# EAGLE design Constant_Register (EAGLE 9.6.2)
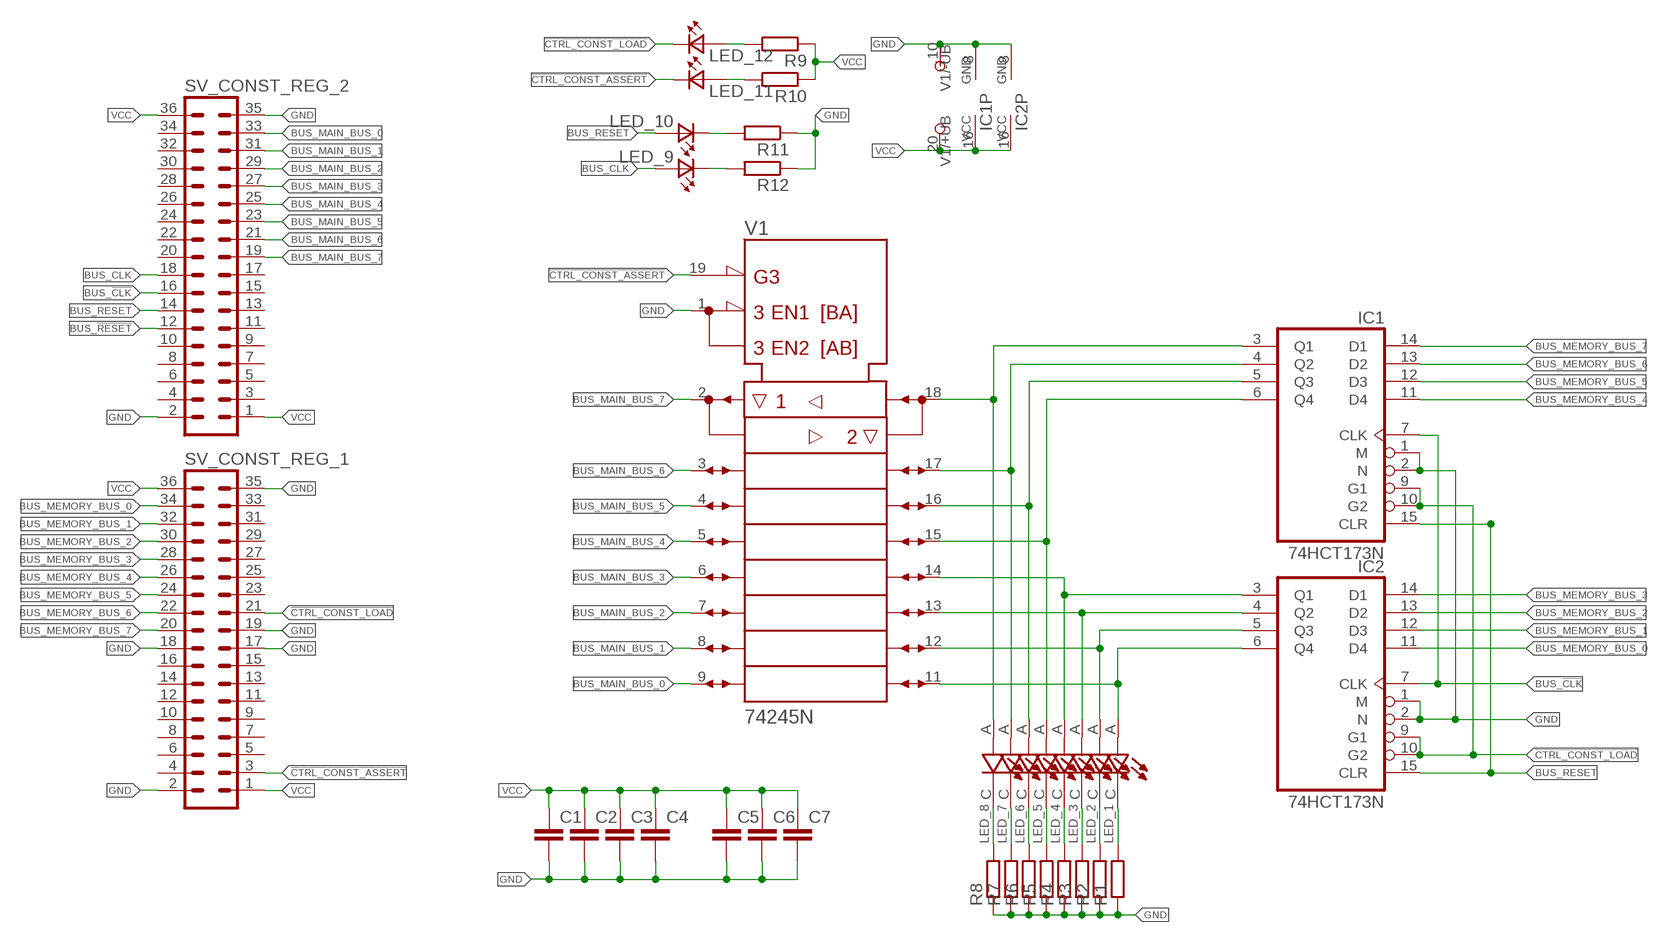
[diagram p0: schematic, sheet 1]

## Parts
C1  C-EUC0805  [C0805]
C2  C-EUC0805  [C0805]
C3  C-EUC0805  [C0805]
C4  C-EUC0805  [C0805]
C5  C-EUC0805  [C0805]
C6  C-EUC0805  [C0805]
C7  C-EUC0805  [C0805]
IC1  74HCT173N  [DIL16]
IC2  74HCT173N  [DIL16]
LED_1  LTST-C193KRKT-5A  [LEDC1608X45N]
LED_2  LTST-C193KRKT-5A  [LEDC1608X45N]
LED_3  LTST-C193KRKT-5A  [LEDC1608X45N]
LED_4  LTST-C193KRKT-5A  [LEDC1608X45N]
LED_5  LTST-C193KRKT-5A  [LEDC1608X45N]
LED_6  LTST-C193KRKT-5A  [LEDC1608X45N]
LED_7  LTST-C193KRKT-5A  [LEDC1608X45N]
LED_8  LTST-C193KRKT-5A  [LEDC1608X45N]
LED_9  LTST-C193TBKT-5A  [0603]
LED_10  LTST-C193TBKT-5A  [0603]
LED_11  LTST-C193TBKT-5A  [0603]
LED_12  LTST-C193TBKT-5A  [0603]
R1  R-EU_R0805  [R0805]
R2  R-EU_R0805  [R0805]
R3  R-EU_R0805  [R0805]
R4  R-EU_R0805  [R0805]
R5  R-EU_R0805  [R0805]
R6  R-EU_R0805  [R0805]
R7  R-EU_R0805  [R0805]
R8  R-EU_R0805  [R0805]
R9  R-EU_R0805  [R0805]
R10  R-EU_R0805  [R0805]
R11  R-EU_R0805  [R0805]
R12  R-EU_R0805  [R0805]
SV_CONST_REG_1  MA18-2  [MA18-2]
SV_CONST_REG_2  MA18-2  [MA18-2]
V1  74245N  [DIL20]

## Nets
!CTRL_CONST_ASSERT: LED_11.1(K2) SV_CONST_REG_1.3 V1.19(!G)
!CTRL_CONST_LOAD: IC1.9(G1) IC1.10(G2) IC2.9(G1) IC2.10(G2) LED_12.1(K2) SV_CONST_REG_1.21
BUS_!CLK: IC1.7(CLK) IC2.7(CLK) SV_CONST_REG_2.16
BUS_!RESET: SV_CONST_REG_2.12
BUS_CLK: LED_9.2(A2) SV_CONST_REG_2.18
BUS_MAIN_BUS_0: SV_CONST_REG_2.33 V1.9(A8)
BUS_MAIN_BUS_1: SV_CONST_REG_2.31 V1.8(A7)
BUS_MAIN_BUS_2: SV_CONST_REG_2.29 V1.7(A6)
BUS_MAIN_BUS_3: SV_CONST_REG_2.27 V1.6(A5)
BUS_MAIN_BUS_4: SV_CONST_REG_2.25 V1.5(A4)
BUS_MAIN_BUS_5: SV_CONST_REG_2.23 V1.4(A3)
BUS_MAIN_BUS_6: SV_CONST_REG_2.21 V1.3(A2)
BUS_MAIN_BUS_7: SV_CONST_REG_2.19 V1.2(A1)
BUS_MEMORY_BUS_0: IC2.11(D4) SV_CONST_REG_1.34
BUS_MEMORY_BUS_1: IC2.12(D3) SV_CONST_REG_1.32
BUS_MEMORY_BUS_2: IC2.13(D2) SV_CONST_REG_1.30
BUS_MEMORY_BUS_3: IC2.14(D1) SV_CONST_REG_1.28
BUS_MEMORY_BUS_4: IC1.11(D4) SV_CONST_REG_1.26
BUS_MEMORY_BUS_5: IC1.12(D3) SV_CONST_REG_1.24
BUS_MEMORY_BUS_6: IC1.13(D2) SV_CONST_REG_1.22
BUS_MEMORY_BUS_7: IC1.14(D1) SV_CONST_REG_1.20
BUS_RESET: IC1.15(CLR) IC2.15(CLR) LED_10.2(A2) SV_CONST_REG_2.14
GND: C1.2 C2.2 C3.2 C4.2 C5.2 C6.2 C7.2 IC1.1(M) IC1.2(N) IC1.8(GND) IC2.1(M) IC2.2(N) IC2.8(GND) R1.1 R2.1 R3.1 R4.1 R5.1 R6.1 R7.1 R8.1 R11.1 R12.1 SV_CONST_REG_1.2 SV_CONST_REG_1.17 SV_CONST_REG_1.18 SV_CONST_REG_1.19 SV_CONST_REG_1.35 SV_CONST_REG_2.2 SV_CONST_REG_2.35 V1.1(DIR) V1.10(-UB)
N$1: LED_8.C R8.2
N$2: LED_7.C R7.2
N$3: LED_6.C R6.2
N$4: LED_5.C R5.2
N$5: LED_4.C R4.2
N$6: LED_3.C R3.2
N$7: LED_2.C R2.2
N$8: LED_1.C R1.2
N$9: IC2.3(Q1) LED_4.A V1.14(B5)
N$10: IC1.4(Q2) LED_7.A V1.17(B2)
N$11: IC2.6(Q4) LED_1.A V1.11(B8)
N$12: IC2.5(Q3) LED_2.A V1.12(B7)
N$13: IC2.4(Q2) LED_3.A V1.13(B6)
N$14: IC1.6(Q4) LED_5.A V1.15(B4)
N$15: IC1.5(Q3) LED_6.A V1.16(B3)
N$16: IC1.3(Q1) LED_8.A V1.18(B1)
N$17: LED_11.2(A2) R10.2
N$18: LED_12.2(A2) R9.2
N$19: LED_9.1(K2) R12.2
N$20: LED_10.1(K2) R11.2
VCC: C1.1 C2.1 C3.1 C4.1 C5.1 C6.1 C7.1 IC1.16(VCC) IC2.16(VCC) R9.1 R10.1 SV_CONST_REG_1.1 SV_CONST_REG_1.36 SV_CONST_REG_2.1 SV_CONST_REG_2.36 V1.20(+UB)
Unconnected: SV_CONST_REG_1.4 SV_CONST_REG_1.5 SV_CONST_REG_1.6 SV_CONST_REG_1.7 SV_CONST_REG_1.8 SV_CONST_REG_1.9 SV_CONST_REG_1.10 SV_CONST_REG_1.11 SV_CONST_REG_1.12 SV_CONST_REG_1.13 SV_CONST_REG_1.14 SV_CONST_REG_1.15 SV_CONST_REG_1.16 SV_CONST_REG_1.23 SV_CONST_REG_1.25 SV_CONST_REG_1.27 SV_CONST_REG_1.29 SV_CONST_REG_1.31 SV_CONST_REG_1.33 SV_CONST_REG_2.3 SV_CONST_REG_2.4 SV_CONST_REG_2.5 SV_CONST_REG_2.6 SV_CONST_REG_2.7 SV_CONST_REG_2.8 SV_CONST_REG_2.9 SV_CONST_REG_2.10 SV_CONST_REG_2.11 SV_CONST_REG_2.13 SV_CONST_REG_2.15 SV_CONST_REG_2.17 SV_CONST_REG_2.20 SV_CONST_REG_2.22 SV_CONST_REG_2.24 SV_CONST_REG_2.26 SV_CONST_REG_2.28 SV_CONST_REG_2.30 SV_CONST_REG_2.32 SV_CONST_REG_2.34

## Library data of the parts
C1-C7 = rcl:C-EU: CAPACITOR, European symbol; SPICEPREFIX: C
IC1 IC2 = 74xx-eu:74*173: 4-bit D type REGISTER, 3-state
LED_1-LED_8 = Dargon's_lib:LTST-C193KRKT-5A: Red 631nm LED Indication - Discrete 2V 0603 (1608 Metric); MANUFACTURER: Lite-On; MAXIMUM_PACKAGE_HEIGHT: 0.45 mm; PARTREV: C; STANDARD: IPC 7351B
LED_9-LED_12 = Dargon's_lib:LTST-C193TBKT-5A: http://octopart.com/ltst-c190tbkt-lite-on-550003
R1-R12 = rcl:R-EU_: RESISTOR, European symbol; SPICEPREFIX: R
SV_CONST_REG_1 SV_CONST_REG_2 = con-lstb:MA18-2: PIN HEADER; OC_FARNELL: unknown; OC_NEWARK: unknown
V1 = 74ttl-din:74*245: Octal BUS TRANSCEIVER, 3-state

## Board
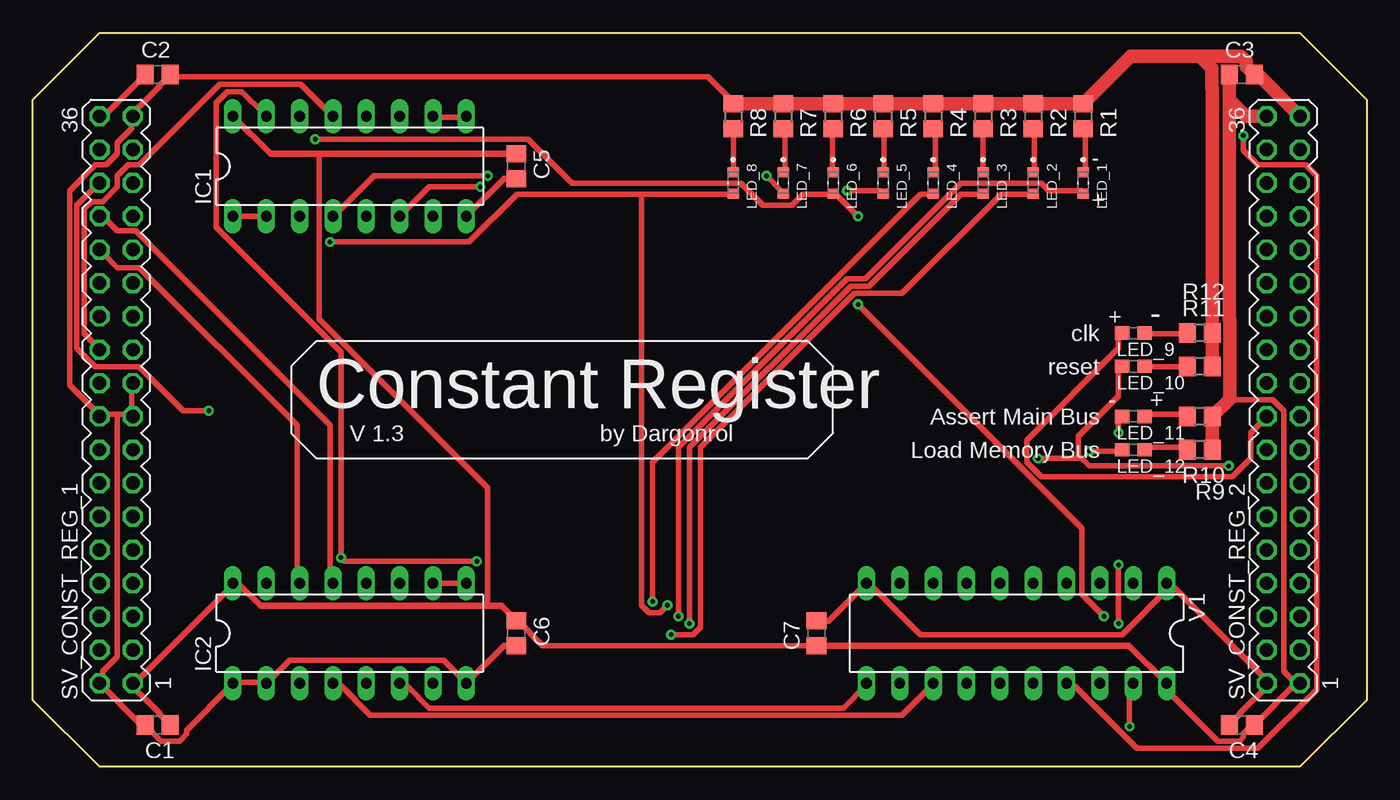
[diagram p1: board, top side]
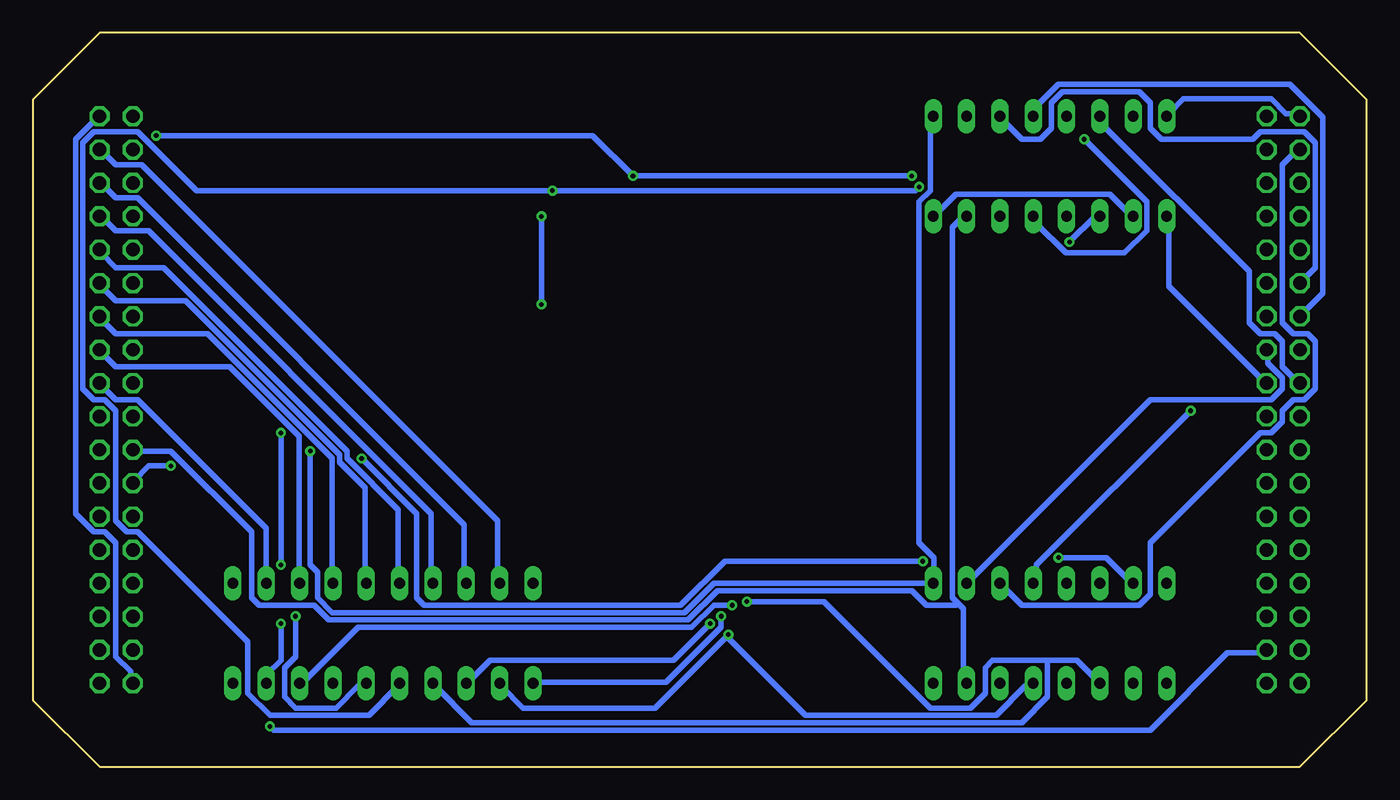
[diagram p2: board, bottom side, seen from below]

Size 101.6 x 55.88 mm. Coordinates in mm from the lower left corner, seen from the top.
Outline: 5.08,0 0,5.08 0,50.8 5.08,55.88 96.52,55.88 101.6,50.8 101.6,5.08 96.52,0 5.08,0
Copper layers (1*16): Top 0.035mm / dielectric 1.5mm / Bottom 0.035mm
Design rules "default *": minimum track width 16mil, minimum drill 0.35mm, track to track 6mil, track to pad 6mil, pad to pad 6mil, via to via 6mil, smd to smd 6mil, copper to edge 40mil, drill to drill 6mil, minimum pad ring 10mil, minimum via ring 8mil, stop-mask expansion 4mil, vias tented up to drill 0mil, thermal gap 10mil

### Footprints (pad centres in the part's own frame; a part is rotated, then mirrored left to right if it is on the bottom)
C0805 = smd 1.3 x 1.5: 1 -0.95,0; 2 0.95,0
DIL16 = drill 0.813 long: 1 -8.89,-3.81; 2 -6.35,-3.81; 3 -3.81,-3.81; 4 -1.27,-3.81; 5 1.27,-3.81; 6 3.81,-3.81; 7 6.35,-3.81; 8 8.89,-3.81; 9 8.89,3.81; 10 6.35,3.81; 11 3.81,3.81; 12 1.27,3.81; 13 -1.27,3.81; 14 -3.81,3.81; 15 -6.35,3.81; 16 -8.89,3.81
LEDC1608X45N = smd 0.81 x 0.93: A 0.81,0; C -0.81,0
0603 = smd 1.1 x 1: 1 -0.85,0; 2 0.85,0
R0805 = smd 1.3 x 1.5: 1 -0.95,0; 2 0.95,0
MA18-2 = drill 1.016 octagon: 1 -21.59,-1.27; 2 -21.59,1.27; 3 -19.05,-1.27; 4 -19.05,1.27; 5 -16.51,-1.27; 6 -16.51,1.27; 7 -13.97,-1.27; 8 -13.97,1.27; 9 -11.43,-1.27; 10 -11.43,1.27; 11 -8.89,-1.27; 12 -8.89,1.27; 13 -6.35,-1.27; 14 -6.35,1.27; 15 -3.81,-1.27; 16 -3.81,1.27; 17 -1.27,-1.27; 18 -1.27,1.27; 19 1.27,-1.27; 20 1.27,1.27; 21 3.81,-1.27; 22 3.81,1.27; 23 6.35,-1.27; 24 6.35,1.27; 25 8.89,-1.27; 26 8.89,1.27; 27 11.43,-1.27; 28 11.43,1.27; 29 13.97,-1.27; 30 13.97,1.27; 31 16.51,-1.27; 32 16.51,1.27; 33 19.05,-1.27; 34 19.05,1.27; 35 21.59,-1.27; 36 21.59,1.27
DIL20 = drill 0.813 long: 1 -11.43,-3.81; 2 -8.89,-3.81; 3 -6.35,-3.81; 4 -3.81,-3.81; 5 -1.27,-3.81; 6 1.27,-3.81; 7 3.81,-3.81; 8 6.35,-3.81; 9 8.89,-3.81; 10 11.43,-3.81; 11 11.43,3.81; 12 8.89,3.81; 13 6.35,3.81; 14 3.81,3.81; 15 1.27,3.81; 16 -1.27,3.81; 17 -3.81,3.81; 18 -6.35,3.81; 19 -8.89,3.81; 20 -11.43,3.81

### Placement (x,y rotation side)
C1  9.53,3.17 180 top
C2  9.53,52.7 0 top
C3  92.08,52.7 0 top
C4  92.08,3.17 180 top
C5  36.83,45.72 270 top
C6  36.83,10.16 270 top
C7  59.69,10.16 90 top
IC1  24.13,45.72 0 top
IC2  24.13,10.16 0 top
LED_1  80.01,44.45 270 top
LED_2  76.2,44.45 270 top
LED_3  72.39,44.45 270 top
LED_4  68.58,44.45 270 top
LED_5  64.77,44.45 270 top
LED_6  60.96,44.45 270 top
LED_7  57.15,44.45 270 top
LED_8  53.34,44.45 270 top
LED_9  83.82,33.02 180 top
LED_10  83.82,30.48 180 top
LED_11  83.82,26.67 0 top
LED_12  83.82,24.13 0 top
R1  80.01,49.53 270 top
R2  76.2,49.53 270 top
R3  72.39,49.53 270 top
R4  68.58,49.53 270 top
R5  64.77,49.53 270 top
R6  60.96,49.53 270 top
R7  57.15,49.53 270 top
R8  53.34,49.53 270 top
R9  88.9,24.13 180 top
R10  88.9,26.67 180 top
R11  88.9,30.48 180 top
R12  88.9,33.02 180 top
SV_CONST_REG_1  6.35,27.94 90 top
SV_CONST_REG_2  95.25,27.94 90 top
V1  74.93,10.16 180 top

### Tracks (layer width: path | path; a pad name or v marks a point on that pad's centre or on a via)
!CTRL_CONST_ASSERT  (via drill 0.35)
  Top 0.406: v82.7,25.43 82.7,26.54 LED_11.1 | v82.7,10.9 v82.7,15.37 | v83.54,3.07 83.54,5.87 83.82,6.15 V1.19
  Bottom 0.406: v82.7,15.37 v82.7,25.43 | v82.7,10.9 82.7,8.1 83.82,6.99 V1.19 | v83.54,3.07 83.26,2.79 16.48,2.79 10.62,8.66 7.82,8.66 SV_CONST_REG_1.3
!CTRL_CONST_LOAD  (via drill 0.35)
  Top 0.406: IC1.10 30.73,49.45 32.97,49.45 IC1.9 | v80.47,24.03 82.7,24.03 LED_12.1 | IC2.9 IC2.10
  Bottom 0.406: v80.47,24.03 80.47,15.37 79.91,14.81 79.91,12.85 78.79,11.73 51.97,11.73 49.73,13.97 IC2.9 32.97,13.97 32.97,15.93 34.09,17.04 34.09,43.03 33.25,43.87 33.25,49.45 IC1.9 | SV_CONST_REG_1.21 7.54,31.57 7.54,30.73 6.43,29.62 6.43,28.78 7.26,27.94 16.48,27.94 30.45,13.97 IC2.10
BUS_!CLK
  Bottom 0.406: 31.15,12.43 31.57,12.85 31.57,41.07 30.73,41.91 IC1.7 | 31.15,12.43 30.73,12.01 30.73,6.43 IC2.7 | SV_CONST_REG_2.16 93.88,24.03 91.08,24.03 84.94,17.88 84.94,12.85 84.38,12.29 80.19,12.29 79.07,11.18 51.69,11.18 49.45,13.41 34.65,13.41 33.53,12.29 31.29,12.29 31.15,12.43
BUS_CLK
  Top 0.406: LED_9.2 82.7,32.97 82.7,31.85 75.72,24.87 75.72,23.19 76.83,22.07 91.36,22.07 92.76,23.47 92.76,25.43 93.88,26.54 SV_CONST_REG_2.18
BUS_MAIN_BUS_0
  Bottom 0.406: V1.9 66.22,13.97 66.22,18.72 93.32,45.82 95.28,45.82 96.39,46.94 SV_CONST_REG_2.33
BUS_MAIN_BUS_1
  Bottom 0.406: V1.8 68.73,13.97 68.73,18.44 93.6,43.31 95.28,43.31 96.39,44.42 SV_CONST_REG_2.31
BUS_MAIN_BUS_2
  Bottom 0.406: V1.7 71.25,13.97 71.25,19.28 92.76,40.79 95.28,40.79 96.39,41.91 SV_CONST_REG_2.29
BUS_MAIN_BUS_3
  Bottom 0.406: V1.6 73.76,13.97 73.76,19.56 77.67,23.47 77.67,24.03 91.64,38 95.28,38 96.39,39.12 SV_CONST_REG_2.27
BUS_MAIN_BUS_4
  Bottom 0.406: V1.5 76.28,13.97 76.28,21.23 78.23,23.19 78.23,23.75 89.97,35.48 95.28,35.48 96.39,36.6 SV_CONST_REG_2.25
BUS_MAIN_BUS_5
  Bottom 0.406: V1.4 78.79,13.97 78.79,23.47 88.29,32.97 95.28,32.97 96.39,34.09 SV_CONST_REG_2.23
BUS_MAIN_BUS_6
  Bottom 0.406: V1.3 81.31,13.97 81.31,25.15 86.61,30.45 95.28,30.45 96.39,31.57 SV_CONST_REG_2.21
BUS_MAIN_BUS_7
  Bottom 0.406: V1.2 83.82,18.16 93.6,27.94 95.28,27.94 96.39,29.06 SV_CONST_REG_2.19
BUS_MEMORY_BUS_0
  Bottom 0.406: IC2.11 26.26,12.29 17.32,12.29 16.48,13.13 16.48,17.04 8.1,25.43 7.26,25.43 6.43,26.26 6.43,27.1 5.59,27.94 4.75,27.94 3.91,28.78 3.91,32.41 4.47,32.97 5.59,32.97 6.43,33.81 6.43,45.82 5.31,46.94 SV_CONST_REG_1.34
BUS_MEMORY_BUS_1  (via drill 0.35)
  Top 0.406: v13.41,27.1 11.46,27.1 8.1,30.45 4.75,30.45 3.35,31.85 3.35,42.75 5.03,44.42 SV_CONST_REG_1.32
  Bottom 0.406: v13.41,27.1 25.15,15.37 25.15,13.97 IC2.12
BUS_MEMORY_BUS_2
  Top 0.406: IC2.13 22.63,13.97 22.63,25.98 7.82,40.79 6.43,40.79 5.31,41.91 SV_CONST_REG_1.30
BUS_MEMORY_BUS_3
  Top 0.406: IC2.14 20.12,13.97 20.12,25.98 8.1,38 6.43,38 5.31,39.12 SV_CONST_REG_1.28
BUS_MEMORY_BUS_4
  Bottom 0.406: SV_CONST_REG_1.26 3.91,38 3.91,47.5 4.75,48.34 8.1,48.34 8.66,47.78 15.65,47.78 16.48,48.62 16.48,50.57 17.32,51.41 23.19,51.41 24.03,50.57 24.03,48.62 24.87,47.78 26.26,47.78 27.94,49.45 IC1.11
BUS_MEMORY_BUS_5
  Bottom 0.406: IC1.12 25.15,49.73 25.15,50.29 23.47,51.97 5.87,51.97 3.35,49.45 3.35,36.04 5.03,34.37 SV_CONST_REG_1.24
BUS_MEMORY_BUS_6
  Top 0.406: IC1.13 22.63,49.73 20.4,51.97 14.25,51.97 8.1,45.82 7.26,45.82 6.43,44.98 6.43,44.15 5.31,43.03 4.47,43.03 3.91,42.47 3.91,32.97 5.03,31.85 SV_CONST_REG_1.22
BUS_MEMORY_BUS_7
  Bottom 0.406: IC1.14 20.12,49.45 20.12,48.9 8.94,37.72 8.94,33.81 8.1,32.97 6.99,32.97 6.43,32.41 6.43,30.45 5.31,29.34 SV_CONST_REG_1.20
BUS_RESET  (via drill 0.35)
  Top 0.406: 79.77,23.61 80.47,22.91 v91.08,22.91 | 79.77,23.61 79.63,23.75 79.63,25.15 82.7,28.22 82.7,30.45 LED_10.2 | IC1.15 17.6,49.73 15.93,51.41 14.81,51.41 13.97,50.57 13.97,41.07 23.47,31.57 v23.47,15.93 23.75,15.65 v33.81,15.65 | v76.56,23.47 79.63,23.47 79.77,23.61
  Bottom 0.406: v91.08,22.91 92.76,22.91 93.88,21.79 SV_CONST_REG_2.14 | v23.47,15.93 19.84,15.93 17.88,13.97 IC2.15 | v76.56,23.47 72.36,19.28 72.36,12.85 71.81,12.29 52.25,12.29 48.9,15.65 v33.81,15.65
GND
  Top 0.406: C1.2 8.66,3.07 9.78,1.96 11.18,1.96 11.73,2.52 11.73,2.79 15.09,6.15 IC2.1 15.37,6.43 17.6,6.43 IC2.2 17.88,6.43 19.56,8.1 31.29,8.1 32.97,6.43 IC2.8 | IC1.2 IC1.1 | 7.54,26.82 6.43,26.82 | 6.43,26.82 5.31,26.82 SV_CONST_REG_1.18 5.03,26.82 2.79,29.06 2.79,43.87 4.75,45.82 5.59,45.82 6.43,46.66 6.43,47.5 7.54,48.62 7.54,49.45 SV_CONST_REG_1.35 | 7.54,26.82 7.54,29.06 SV_CONST_REG_1.19 | 7.54,26.82 SV_CONST_REG_1.17 | 6.43,26.82 6.43,8.38 5.31,7.26 5.31,6.43 SV_CONST_REG_1.2 | SV_CONST_REG_2.2 94.16,6.43 86.61,13.97 V1.1 86.61,13.69 82.98,10.06 67.61,10.06 63.7,13.97 V1.10 | C2.2 10.62,52.53 51.41,52.53 53.09,50.85 R8.1
  Top 0.508: C2.2 9.63,51.86 9.63,51.79 7.62,49.77 SV_CONST_REG_1.35 | C5.2 35.88,44.77 IC1.8 | C6.2 35.88,9.21 IC2.8 | C1.2 8.26,3.17 SV_CONST_REG_1.2 | C7.2 60.64,11.11 V1.10 | C4.2 91.97,4.02 91.97,4.09 93.98,6.11 SV_CONST_REG_2.2 | C3.2 93.34,52.7
  Top 1.016: 93.34,52.7 SV_CONST_REG_2.35 | R8.1 R7.1 R6.1 R5.1 R4.1 R3.1 R2.1 R1.1 83.64,54.12 88.9,54.12 | C3.2 92.44,53.3 92.44,53.73 92.05,54.12 88.9,54.12 | R11.1 R12.1 89.85,51.65 89.81,51.68 89.81,53.2 88.9,54.12
  Bottom 0.406: IC1.1 15.09,41.91 15.09,36.6 7.82,29.34 SV_CONST_REG_1.19 | IC1.8 32.97,41.91 31.29,43.59 19.56,43.59 17.88,41.91 IC1.2 | SV_CONST_REG_2.2 94.16,6.43 94.16,7.26 95.28,8.38 95.28,17.04 96.11,17.88 96.95,17.88 98.35,19.28 98.35,47.78 96.67,49.45 SV_CONST_REG_2.35
N$1
  Top 0.406: LED_8.C 53.37,45.26 53.37,48.34 R8.2
N$2
  Top 0.406: LED_7.C 57.28,45.26 57.28,48.34 R7.2
N$3
  Top 0.406: LED_6.C 60.91,45.26 60.91,48.34 R6.2
N$4
  Top 0.406: LED_5.C 64.82,45.26 64.82,48.34 R5.2
N$5
  Top 0.406: LED_4.C 68.73,45.26 68.73,48.34 R4.2
N$6
  Top 0.406: LED_3.C 72.36,45.26 72.36,48.34 R3.2
N$7
  Top 0.406: LED_2.C 76.28,45.26 76.28,48.34 R2.2
N$8
  Top 0.406: LED_1.C 80.19,45.26 80.19,48.34 R1.2
N$9  (via drill 0.35)
  Top 0.406: v47.22,12.57 47.22,23.19 67.61,43.59 68.45,43.59 LED_4.A
  Bottom 0.406: v47.22,12.57 41.35,12.57 33.25,4.47 30.18,4.47 29.06,5.59 29.06,7.54 28.5,8.1 24.31,8.1 | 24.31,8.1 22.07,8.1 IC2.3 | 24.31,8.1 24.31,5.31 26.26,3.35 68.17,3.35 70.97,6.15 V1.14
N$10  (via drill 0.35)
  Top 0.406: v55.88,44.98 57,43.87 LED_7.A | v34.65,44.98 25.98,44.98 22.91,41.91 IC1.4 | v92.2,48.06 92.2,46.94 93.32,45.82 96.95,45.82 97.79,44.98 97.79,5.87 93.32,1.4 84.1,1.4 79.35,6.15 78.79,6.15 V1.17
  Bottom 0.406: v34.65,44.98 v55.88,44.98 58.95,48.06 v92.2,48.06
N$11  (via drill 0.35)
  Top 0.406: v49.17,11.46 49.17,24.31 62.03,37.16 63.42,37.16 70.69,44.42 76.83,44.42 77.39,43.87 79.91,43.87 LED_1.A | IC2.6 27.94,6.15 28.5,6.15 30.18,4.47 61.75,4.47 63.42,6.15 V1.11
  Bottom 0.406: v49.17,11.46 49.17,10.62 53.37,6.43 63.42,6.43 V1.11
N$12  (via drill 0.35)
  Top 0.406: v48.62,10.06 50.29,10.06 50.85,10.62 50.85,24.31 62.59,36.04 66.22,36.04 73.76,43.59 76,43.59 LED_2.A
  Bottom 0.406: V1.12 65.94,6.15 64.26,4.47 54.2,4.47 v48.62,10.06 48.62,9.78 42.75,3.91 28.22,3.91 25.98,6.15 25.43,6.15 IC2.5
N$13  (via drill 0.35)
  Top 0.406: v50.01,10.9 50.01,24.31 62.31,36.6 63.7,36.6 70.69,43.59 72.36,43.59 LED_3.A | IC2.4 22.91,6.15 23.47,6.15 25.7,3.91 66.22,3.91 68.45,6.15 V1.13
  Bottom 0.406: v50.01,10.9 52.81,8.1 66.78,8.1 68.45,6.43 V1.13
N$14  (via drill 0.35)
  Top 0.406: v62.03,43.87 64.54,43.87 LED_5.A | v34.09,44.15 30.18,44.15 IC1.6
  Bottom 0.406: v34.09,44.15 34.37,43.87 v62.03,43.87 89.13,43.87 93.6,48.34 96.95,48.34 97.79,47.5 97.79,28.78 96.95,27.94 96.11,27.94 95.28,27.1 95.28,18.72 94.44,17.88 93.6,17.88 85.22,9.5 85.22,5.59 83.54,3.91 76,3.91 73.76,6.15 V1.15
N$15  (via drill 0.35)
  Top 0.406: v21.51,47.78 37.72,47.78 41.07,44.42 53.92,44.42 55.6,42.75 57.84,42.75 58.67,43.59 60.91,43.59 LED_6.A 61.19,43.59 v62.87,41.91 | v81.58,11.46 79.91,13.13 79.91,18.16 v62.87,35.2
  Bottom 0.406: v21.51,47.78 16.76,43.03 16.76,40.79 18.44,39.12 22.91,39.12 25.15,41.35 25.15,41.91 IC1.5 | v81.58,11.46 81.58,8.38 82.42,7.54 82.42,5.31 81.58,4.47 78.51,4.47 76.83,6.15 76.28,6.15 V1.16 | v62.87,41.91 v62.87,35.2
N$16  (via drill 0.35)
  Top 0.406: 46.38,43.59 36.88,43.59 33.25,39.95 v22.63,39.95 | 46.38,43.59 53.09,43.59 LED_8.A | v48.34,12.29 47.78,11.73 46.94,11.73 46.38,12.29 46.38,43.59
  Bottom 0.406: v22.63,39.95 20.68,41.91 IC1.3 | v48.34,12.29 49.73,12.29 51.41,10.62 76.83,10.62 81.03,6.43 V1.18
N$17
  Top 0.406: LED_11.2 84.94,26.82 87.73,26.82 R10.2
N$18
  Top 0.406: LED_12.2 84.94,24.31 87.73,24.31 R9.2
N$19
  Top 0.406: LED_9.1 84.94,32.97 87.73,32.97 R12.2
N$20
  Top 0.406: LED_10.1 84.94,30.45 87.73,30.45 R11.2
VCC
  Top 0.406: C4.1 92.76,3.07 92.2,2.52 92.2,2.23 91.92,1.96 90.25,1.96 86.61,5.59 86.61,6.15 V1.20 | 15.37,13.97 7.82,6.43 SV_CONST_REG_1.1 | C7.1 59.51,9.22 38.84,9.22 36.88,11.18 C6.1 | 21.79,46.67 21.79,34.09 34.65,21.23 34.65,12.24 | 91.16,27.98 91.64,27.94 94.44,27.94 95.28,27.1 95.28,7.26 96.11,6.43 SV_CONST_REG_2.1
  Top 0.508: C2.1 5.4,49.53 SV_CONST_REG_1.36 | C5.1 21.79,46.67 18.1,46.67 IC1.16 | C6.1 35.7,12.24 34.65,12.24 17.34,12.24 15.61,13.97 15.37,13.97 IC2.16 | C1.1 9.63,4.02 9.63,4.09 7.62,6.11 SV_CONST_REG_1.1 | C7.1 83.5,9.21 V1.20 | C4.1 96.2,6.35 SV_CONST_REG_2.1
  Top 1.016: R9.1 R10.1 91.16,27.98 91.16,34.04 91.12,34.08 91.12,50.8 | 91.12,50.8 C3.1 | 91.12,50.8 92.39,49.53 SV_CONST_REG_2.36
  Bottom 0.406: SV_CONST_REG_1.36 5.31,49.73 6.15,49.73 7.26,50.85 13.97,50.85 15.09,49.73 IC1.16

### Text on the board
tPlace: - | + | + | - | clk | LED_9 | reset | Constant Register | LED_10 | Assert Main Bus | - | + | V 1.3 | by Dargonrol | LED_11 | Load Memory Bus | LED_12